# Altium schematic sheet Mission_schem.SchDoc
size A4
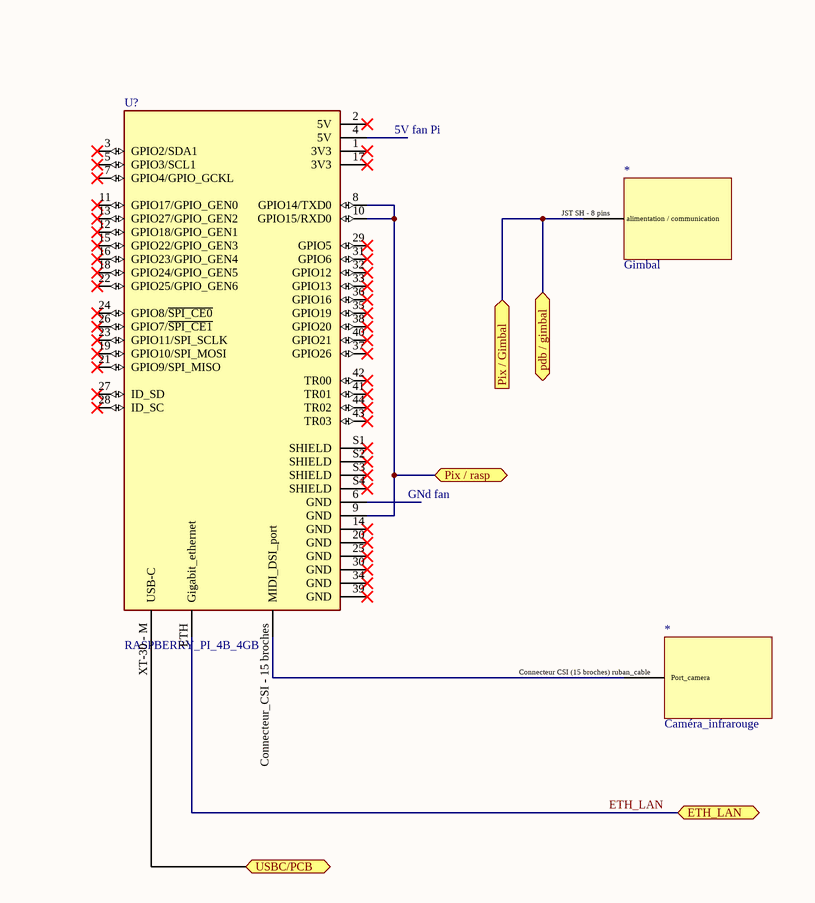
[diagram p0: Mission_schem.SchDoc, right]

## Parts
(Parts that share a designator on the sheet are numbered #1, #2 ... from top to bottom, then left to right.)
*#1  Gimbal
*#2  Caméra_infrarouge
U?  RASPBERRY_PI_4B_4GB  [MODULE_RASPBERRY_PI_4B_4GB]

## Ports
ETH_LAN (bidir), pdb / gimbal (bidir), Pix / Gimbal (in), Pix / rasp (bidir), USBC/PCB (bidir)

## Nets
ETH_LAN: U?.ETH(Gigabit_ethernet) ; port ETH_LAN
pdb / gimbal: *#1.JST_SH_-_8_pins(alimentation_/_communication) ; port Pix / Gimbal, port pdb / gimbal
Pix / rasp: U?.8(GPIO14/TXD0) U?.9(GND) U?.10(GPIO15/RXD0) ; port Pix / rasp
Net*#2_Connecteur CSI (15 broches) ruban_cable: *#2.Connecteur_CSI_(15_broches)_ruban_cable(Port_camera) U?.Connecteur_CSI_-_15_broches(MIDI_DSI_port)

Not connected (* = marked no-connect by the designer): U? 1(3V3)* 2(5V)* 3(GPIO2/SDA1)* 4(5V) 5(GPIO3/SCL1)* 6(GND) 7(GPIO4/GPIO_GCKL)* 11(GPIO17/GPIO_GEN0)* 12(GPIO18/GPIO_GEN1)* 13(GPIO27/GPIO_GEN2)* 14(GND)* 15(GPIO22/GPIO_GEN3)* 16(GPIO23/GPIO_GEN4)* 17(3V3)* 18(GPIO24/GPIO_GEN5)* 19(GPIO10/SPI_MOSI)* 20(GND)* 21(GPIO9/SPI_MISO)* 22(GPIO25/GPIO_GEN6)* 23(GPIO11/SPI_SCLK)* 24(GPIO8/~{SPI_CE0})* 25(GND)* 26(GPIO7/~{SPI_CE1})* 27(ID_SD)* 28(ID_SC)* 29(GPIO5)* 30(GND)* 31(GPIO6)* 32(GPIO12)* 33(GPIO13)* 34(GND)* 35(GPIO19)* 36(GPIO16)* 37(GPIO26)* 38(GPIO20)* 39(GND)* 40(GPIO21)* 41(TR01)* 42(TR00)* 43(TR03)* 44(TR02)* S1(SHIELD)* S2(SHIELD)* S3(SHIELD)* S4(SHIELD)* XT-30 - M(USB-C_)

## Notes on the sheet
- 5V fan Pi
- GNd fan

## Library data of the parts
U? = RASPBERRY_PI_4B_4GB: BCM2711 Raspberry Pi 4 Model B 4GB - ARMÂ® CortexÂ®-A72 MPU Embedded Evaluation Board; MP: RASPBERRY PI 4B/4GB; SnapEDA_Link: https://www.snapeda.com/parts/RASPBERRY%20PI%204B/4GB/Raspberry+Pi/view-part/?ref=snap; Package: None; Value: *; MF: Raspberry Pi; Check_prices: https://www.snapeda.com/parts/RASPBERRY%20PI%204B/4GB/Raspberry+Pi/view-part/?ref=eda